# Altium schematic sheet PWR&RELAY.SchDoc
size A
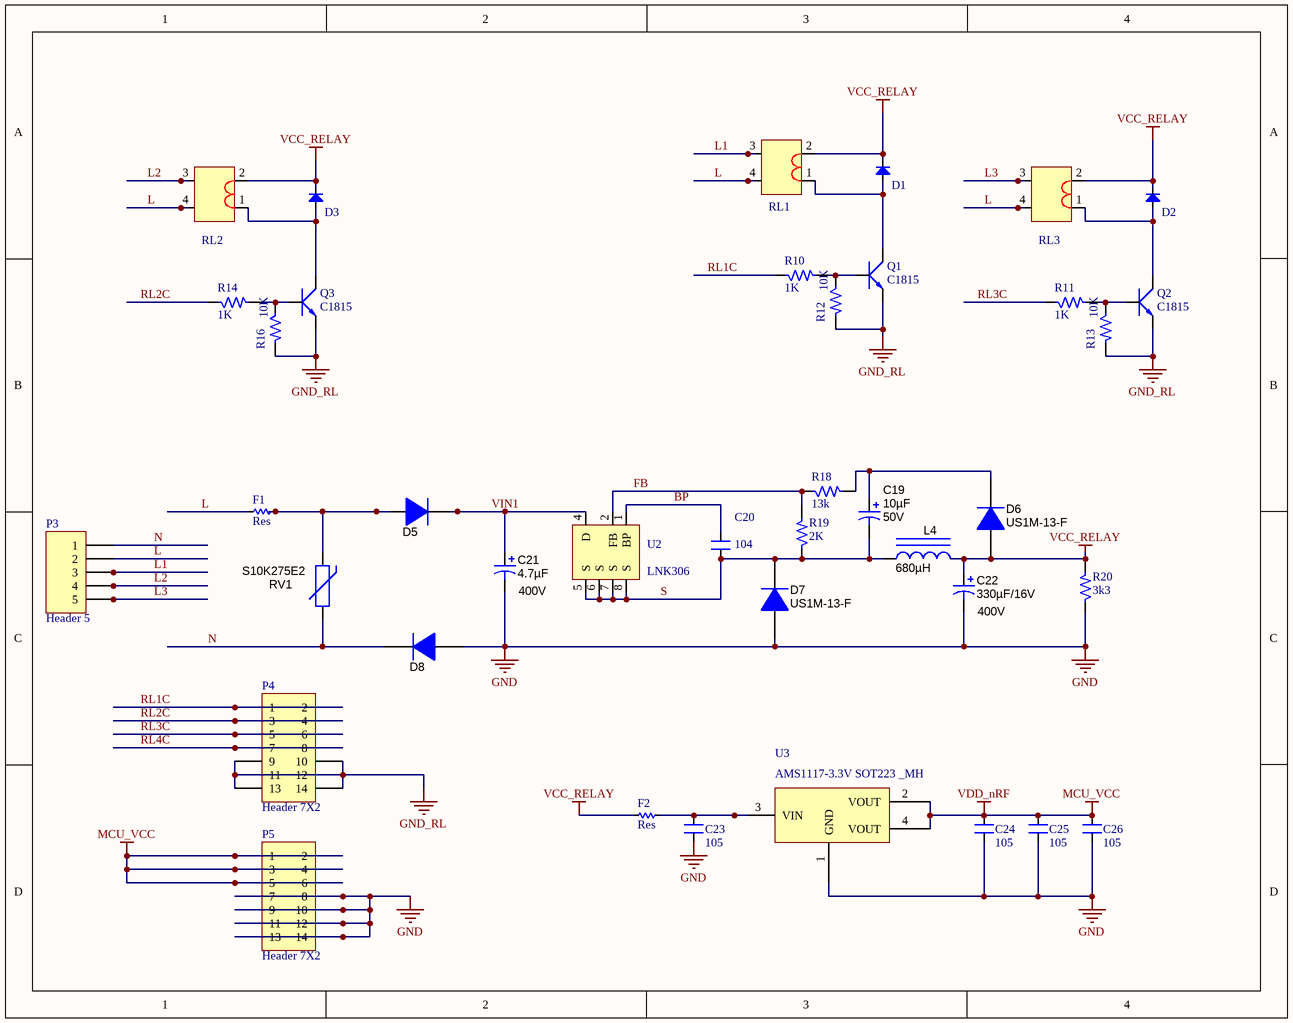
[diagram p0: PWR&RELAY.SchDoc]

## Parts
C19  ValueDisplayed: 10µF  Value2: 50V  [NHG_500x1100]  (hidden comment: ECA-1HHG100)
C20  104  [0805_HV]
C21  ValueDisplayed: 4.7µF  Value2: 400V  [PANACAP-G-GENERIC]  (hidden comment: 400AX6R8M8x11)
C22  ValueDisplayed: 330µF/16V  Value2: 400V  [CAPPRD350W60D800H1100]  (hidden comment: 400AX6R8M8x11)
C23  105  [0805_HV]
C24  105  [0805_HV]
C25  105  [0805_HV]
C26  105  [0805_HV]
D1  Diode SMD  [DIO-SMD-123]  (value not drawn)
D2  Diode SMD  [DIO-SMD-123]  (value not drawn)
D3  Diode SMD  [DIO-SMD-123]  (value not drawn)
D5  US1M-13-F  [SMB]  (value not drawn)
D6  US1M-13-F  [SMB]
D7  US1M-13-F  [SMB]
D8  US1M-13-F  [SMB]  (value not drawn)
F1  Res  [1206]
F2  Res  [1206]
L4  ValueDisplayed: 680µH  [IND_WE-TI_8095]  (hidden comment: 7447480331)
P3  Header 5  [CONWALL_SWITH-3]
P4  Header 7X2  [CON14_1.27]
P5  Header 7X2  [CON14_1.27]
Q1  C1815  [SOT23B]
Q2  C1815  [SOT23B]
Q3  C1815  [SOT23B]
R10  1K  [0603]
R11  1K  [0603]
R12  10K  [0603]
R13  10K  [0603]
R14  1K  [0603]
R16  10K  [0603]
R18  13k  [0805_HV]
R19  2K  [0805_HV]
R20  3k3  [0805_HV]
RL1  Component_1  [AZ7705]  (value not drawn)
RL2  Component_1  [AZ7705]  (value not drawn)
RL3  Component_1  [AZ7705]  (value not drawn)
RV1  S10K275E2  [VAR_S10K275E2]
U2  LNK306  [SOP 7]
U3  AMS1117-3.3V SOT223 _MH  [SOT223]

## Nets
GND: C21.2(-) C22.2(-) C23.1 C24.1 C25.1 C26.1 D7.2(A) D8.2(A) P5.7 P5.8 P5.9 P5.10 P5.11 P5.12 P5.13 P5.14 R20.1 U3.1(GND)
GND_RL: P4.9 P4.10 P4.11 P4.12 P4.13 P4.14 Q1.3(E) Q2.3(E) Q3.3(E) R12.2 R13.2 R16.2
MCU_VCC: C24.2 C25.2 C26.2 P5.1 P5.2 P5.3 P5.4 P5.5 P5.6 U3.2(VOUT) U3.4(VOUT)  [also labelled VDD_nRF]
VCC_RELAY: C22.1(+) D1.2(K) D2.2(K) D3.2(K) D6.2(A) F2.2 L4.2 R20.2 RL1.2 RL2.2 RL3.2
BP: C20.2 U2.1(BP)
FB: R18.1 R19.2 U2.2(FB)
L: F1.2 P3.2 RL1.4 RL2.4 RL3.4
L1: P3.3 RL1.3
L2: P3.4 RL2.3
L3: P3.5 RL3.3
N: D8.1(K) P3.1 RV1.1
RL1C: P4.1 P4.2 R10.1
RL2C: P4.3 P4.4 R14.1
RL3C: P4.5 P4.6 R11.1
RL4C: P4.7 P4.8
S: C19.2(-) C20.1 D7.1(K) L4.1 R19.1 U2.5(S) U2.6(S) U2.7(S) U2.8(S)
VIN1: C21.1(+) D5.1(K) U2.4(D)
NetC19_1: C19.1(+) D6.1(K) R18.2
NetC23_2: C23.2 F2.1 U3.3(VIN)
NetD1_1: D1.1(A) Q1.2(C) RL1.1
NetD2_1: D2.1(A) Q2.2(C) RL3.1
NetD3_1: D3.1(A) Q3.2(C) RL2.1
NetD5_2: D5.2(A) F1.1 RV1.2
NetQ1_1: Q1.1(B) R10.2 R12.1
NetQ2_1: Q2.1(B) R11.2 R13.1
NetQ3_1: Q3.1(B) R14.2 R16.1

## Library data of the parts
C19 = ECA-1HHG100: CAP, AL, 10 µF, 50 V, +/- 20%, TH; Manufacturer: Panasonic; Polarized: Y; CompType: Capacitor; Value: 10uF; U/M: EA; Cap_F: 0.00001; Tolerance_%: 20; VDC_V: 50; IRMS_A: 0.039; TaMin_C: -55; TaMax_C: 105; Cap_Case: 5x11mm; SizeAreaWB_mm2: 49; SizeArea_mm2: 25; SizeX_mm: 5; SizeZ_mm: 12; AEC Category: Q200; AEC Qualified: N; SymbolVersion: 2008-07-09; PartNumber: ECA-1HHG100; PackageReference: D5xL11mm; RoHS: Y; MountType: TH; Technology: AL; Series: NHG; SizeY_mm: 5; Publisher: Texas Instruments; LatestRevisionDate: 2017-06-22; ComponentLink1Description: Datasheet link; ComponentLink1URL: https://industrial.panasonic.com/cdbs/www-data/pdf/RDF0000/ABA0000C75.pdf; Supplier 1: Digi-Key; Supplier Part Number 1: P5567-ND; Supplier 2: Newark; Supplier Part Number 2: 96K9161; Supplier 3: Mouser; Supplier Part Number 3: 667-ECA-1HHG100; AEC Grade: N/A
C20 C23-C26 = CM: Cap SMD; Value: 103
C21 C22 = 400AX6R8M8x11: CAP, AL, 6.8uF, 400V, +/-20%, TH; Manufacturer: Rubycon; Polarized: Y; CompType: Capacitor; U/M: EA; Cap_F: 0.0000068; Tolerance_%: 20; Value1: Unknown; VDC_V: 400; TaMin_C: -40; TaMax_C: 105; Cap_Case: 8x11; SymbolVersion: 2008-07-09; Value: 6.8uF; PartNumber: 400AX6R8M8x11; PackageReference: 8x11; RoHS: Y; MountType: TH; Technology: AL; Series: AX; Publisher: Texas Instruments; LatestRevisionDate: 2013-08-02; ComponentLink1Description: Datasheet link; ComponentLink1URL: http://www.rubycon.co.jp/de/catalog/e_pdfs/aluminum/e_ax.pdf
D1-D3 = Diode SMD: Default Diode; Code - JEDEC: DO-214-AB; Value: 1N5007; Published: 8-Jun-2000; Revision: July-2002: Re-released for DXP Platform.; Publisher: Altium Limited
D5-D8 = MURS160-13-F: Diode, Ultrafast, 600V, 1A, SMB; Manufacturer: Diodes Inc.; U/M: EA; Vf_V: 1.25; Value2: 1.25V; Io_A: 1; Vr_V: 600; TJmax_C: 150; RJC_CperW: 13; PartNumber: US1M-13-F; CompType: Diode; SymbolVersion: 2008-12-08; MountType: SMT; RoHS: Y; Value: 600V; PackageReference: SMB; Value1: 1A; Type: Ultrafast; Published: 2008-06-26; Publisher: Texas Instruments; LatestRevisionDate: 2013-06-21; ComponentLink1Description: Datasheet link; ComponentLink1URL: http://www.diodes.com/datasheets/ds30130.pdf; Supplier 1: Digi-Key; Supplier 2: Mouser; Supplier 3: Farnell
F1 F2 = Res-SMD: Resistor; Manufacturer: Generic Components; Class: Passive; Published: 08/06/2000; Publisher: Altium Hobart Technology Centre
L4 = 7447480331: Inductor, Wirewound, Ferrite, 330 µH, 1.4 A, 0.3 ohm, TH; Manufacturer: Wurth Elektronik; Value: 330uH; Ind_H: 330.0E-6; Imax_A: 1.4; Irms: 1.4A @ 40C rise; Isat: 1.6A @ 10% inductance drop; DCR_ohm: 0.3; Value1: 0.3 ohm; Value2: 1.4A; AEC Category: Q200; AEC Qualified: N; SymbolVersion: 2008-07-23; CompType: Inductor; PartNumber: 7447480331; Technology: Wirewound; MountType: TH; Material: Ferrite; PackageReference: TH, Dia 10.5mm; Published: 2008-06-26; Publisher: Texas Instruments; LatestRevisionDate: 2016-06-15; ComponentLink1Description: Datasheet link; ComponentLink1URL: http://katalog.we-online.de/pbs/datasheet/7447480331.pdf; RoHS: Y; Supplier 1: Digi-Key; Supplier Part Number 1: 732-4196-ND; Supplier 2: Mouser; Supplier Part Number 2: 710-7447480331; Supplier 3: Farnell; Supplier Part Number 3: 2211733; AEC Grade: N/A
P3 = Header 5: Header, 5-Pin; LatestRevisionDate: 17-Jul-2002; LatestRevisionNote: Re-released for DXP Platform.; Publisher: Altium Limited
P4 P5 = Header 7X2: Header, 7-Pin, Dual row; LatestRevisionDate: 17-Jul-2002; LatestRevisionNote: Re-released for DXP Platform.; Publisher: Altium Limited
Q1-Q3 = C1815: NPN 600mW, ECB; Value: C1815
R10-R14 R16 R18-R20 = R: Resistor 1/4W; Value: R1/4W - 1K
RV1 = S10K275E2: Varistor 275V RMS 10MM Radial, TH; Manufacturer: EPCOS Inc; SymbolCreator: a0412235; SymbolVersion: 2012-06-04; PartNumber: S10K275E2; MountType: TH; ComponentLink1Description: Datasheet URL; ComponentLink1URL: http://www.epcos.com/inf/70/db/var_08/SIOV_Leaded_AdvanceD.pdf; RoHS: Y; PackageReference: 10mm Radial; Publisher: Texas Instruments; LatestRevisionDate: 2013-02-24; Supplier 1: Digi-Key; Supplier Part Number 1: 495-1433-ND
U2 = Component_1